# Altium schematic sheet POW.SchDoc
size A4; SheetNumber: 2; SheetTotal: 5
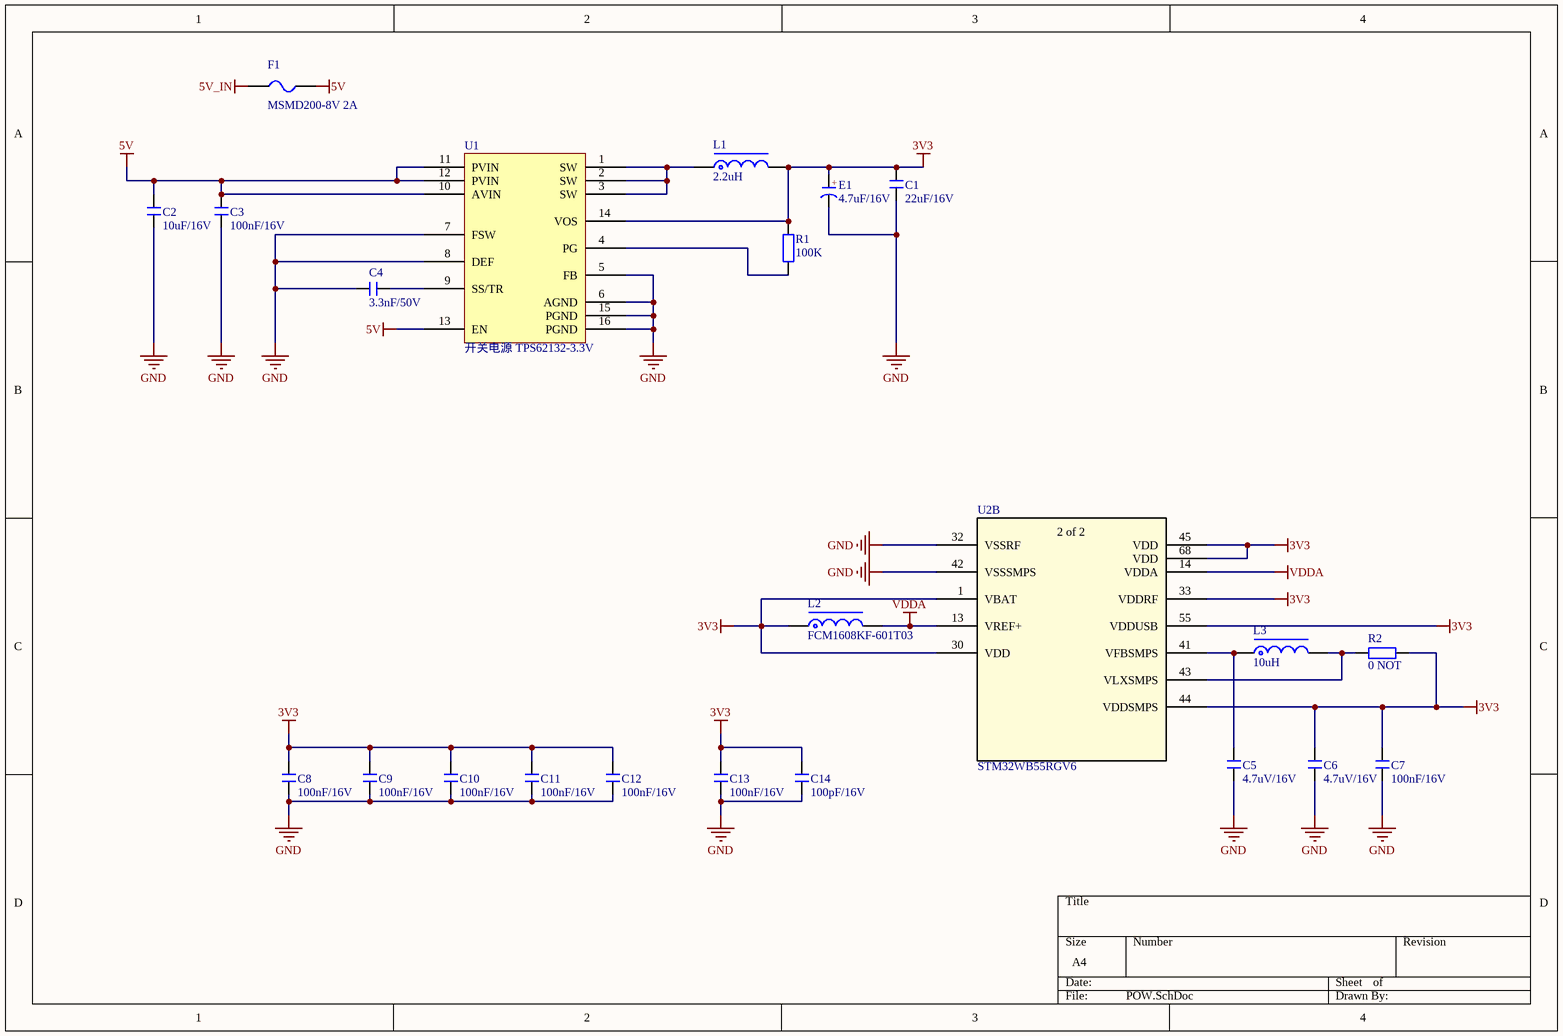
[diagram p0: POW.SchDoc]

## Parts
C1  22uF/16V  [C 0805_L]
C2  10uF/16V  [C 0603_L]
C3  100nF/16V  [C 0402_L]
C4  3.3nF/50V  [C 0402_L]
C5  4.7uV/16V  [C 0603_L]
C6  4.7uV/16V  [C 0603_L]
C7  100nF/16V  [C 0402_L]
C8  100nF/16V  [C 0402_L]
C9  100nF/16V  [C 0402_L]
C10  100nF/16V  [C 0402_L]
C11  100nF/16V  [C 0402_L]
C12  100nF/16V  [C 0402_L]
C13  100nF/16V  [C 0402_L]
C14  100pF/16V  [C 0402_L]
E1  4.7uF/16V  [CD A(3216)]
F1  MSMD200-8V 2A  [FU 0603]
L1  2.2uH  [电感XFL4020]
L2  FCM1608KF-601T03  [L 0402]
L3  10uH  [L 0805]
R1  100K  [R 0402_L]
R2  0 NOT  [R 0603_L]
U1  开关电源 TPS62132-3.3V  [QFN16]
U2  STM32WB55RGV6  [VFQFN68-8x8mm-M]  (part B of 2)

## Nets
3V3: C1.1 C6.2 C7.2 C8.2 C9.2 C10.2 C11.2 C12.2 C13.2 C14.2 E1.1(A) L1.2 L2.1 R1.2 R2.1 U1.14(VOS) U2.1(VBAT) U2.30(VDD) U2.33(VDDRF) U2.44(VDDSMPS) U2.45(VDD) U2.55(VDDUSB) U2.68(VDD)
5V: C2.2 C3.2 F1.2 U1.10(AVIN) U1.11(PVIN) U1.12(PVIN) U1.13(EN)
5V_IN: F1.1
GND: C1.2 C2.1 C3.1 C4.1 C5.1 C6.1 C7.1 C8.1 C9.1 C10.1 C11.1 C12.1 C13.1 C14.1 E1.2(K) U1.5(FB) U1.6(AGND) U1.7(FSW) U1.8(DEF) U1.15(PGND) U1.16(PGND) U2.32(VSSRF) U2.42(VSSSMPS)
VDDA: L2.2 U2.13(VREF+) U2.14(VDDA)
NetC4_2: C4.2 U1.9(SS/TR)
NetC5_2: C5.2 L3.1 U2.41(VFBSMPS)
NetL1_1: L1.1 U1.1(SW) U1.2(SW) U1.3(SW)
NetL3_2: L3.2 R2.2 U2.43(VLXSMPS)
NetR1_1: R1.1 U1.4(PG)

## Notes on the sheet
- (in symbol C-CD) +
- (in symbol STM32WB55RGV6, part B) 2 of 2

## Library data of the parts
C1 = C: 贴片电容; 主类型: 电容; 值精度: ±10%; 元件封装: 0805; 具体类型: 陶瓷电容; 封装类型: 贴片; 温度漂移: X7R（10%）; 温度范围: -55°C ~ 125°C; 生产商: SAMSUNG(三星); 生产商零件编码: CL21A226KOQNNNE; 值/型号: 22uF/16V; 立创编号: C296720
C2 = C: 贴片电容; 主类型: 电容; 值精度: ±10%; 元件封装: 0603; 具体类型: 陶瓷电容; 封装类型: 贴片; 温度漂移: X5R; 温度范围: -55°C ~ 125°C; 生产商: SAMSUNG(三星); 生产商零件编码: CL10A106MO8NQNC; 值/型号: 10uF/16V; 立创编号: C92487C70462
C3 C7-C13 = C: 贴片电容; 主类型: 电容; 值精度: ±10%; 元件封装: 0402; 具体类型: 陶瓷电容; 封装类型: 贴片; 温度漂移: X7R（15%）; 温度范围: -55°C ~ 125°C; 生产商: YAGEO(国巨); 生产商零件编码: CC0402KRX7R7BB104; 值/型号: 100nF/16V; 立创编号: C60474
C4 = C: 贴片电容; 主类型: 电容; 值精度: ±5%; 元件封装: 0402; 具体类型: 陶瓷电容; 封装类型: 贴片; 温度漂移: X7R（5%）; 温度范围: -55°C ~ 125°C; 生产商: YAGEO(国巨); 生产商零件编码: CC0402JRX7R9BB332; 值/型号: 3.3nF/50V; 立创编号: C541447
C5 C6 = C: 贴片电容; 主类型: 电容; 值/型号: 4.7uF/16V; 值精度: ±10%; 元件封装: 0603; 具体类型: 陶瓷电容; 封装类型: 贴片; 温度漂移: X5R（10%）; 温度范围: -55°C ~ 125°C; 生产商: muRata(村田); 生产商零件编码: GRM188R61C475KE11D; 立创编号: C77045
C14 = C: 贴片电容; 主类型: 电容; 值精度: ±5%; 元件封装: 0402; 具体类型: 陶瓷电容; 封装类型: 贴片; 温度漂移: NP0（5%）; 温度范围: -55°C ~ 125°C; 生产商: YAGEO(国巨); 生产商零件编码: CC0402JRNPO7BN101; 值/型号: 100pF/16V; 立创编号: C526991
E1 = C-CD: 聚合物电容 4.7uF/16V; 主类型: 电容; 值精度: ±20%; 元件封装: CASE-A_3216; 封装类型: 贴片; 温度范围: -55℃ ~ +105℃; 生产商: Sunlord(顺络); 生产商零件编码: TC211A475M016A; 值/型号: 4.7uF/16V; 具体类型: 聚合物电容; 立创编号: C136628
F1 = FU: 贴片保险丝
L1 = L-CD: XFL4020-222MEB; 主类型: 电感; 元件封装: 4020; 具体类型: 功率电感; 封装类型: 贴片; 温度范围: -40-125; 生产商: Coilcraft; 类型备注: 淘宝采购; 值/型号: XFL4020-222MEB; 生产商零件编码: XFL4020-222MEB; 立创编号: https://detail.tmall.com/item.htm?spm=a230r.1.14.16.717a6f292tX0SR&id=619184428761&ns=1&abbucket=12
L2 = L-CD: 0805; 主类型: 电感; 元件封装: 0603; 具体类型: 功率电感; 封装类型: 贴片; 温度范围: -40-125; 生产商: 台庆; 值/型号: FCM1608KF-601T03; 生产商零件编码: FCM1608KF-601T03; 立创编号: C141723
L3 = L-CD: 74479777310A; 主类型: 电感; 元件封装: 0805; 具体类型: 功率电感; 封装类型: 贴片; 温度范围: -40-125; 生产商: WE; 类型备注: 淘宝采购; 值/型号: 74479777310A; 生产商零件编码: 74479777310A
R1 = R: 贴片电阻 0402 1%; 主类型: 电阻; 元件封装: 0402; 封装类型: 贴片; 温度漂移: ±100ppm/℃; 生产商: 国巨; 生产商零件编码: RC0402FR-07100KL; 值/型号: 100K; 值精度: ±1%; 具体类型: 贴片电阻; 立创编号: C60491
R2 = R: 贴片电阻 0402 1%; 主类型: 电阻; 值/型号: 0; 值精度: ±5%; 元件封装: 0603; 封装类型: 贴片; 温度漂移: -200ppm/℃~400ppm/℃; 生产商: 华新科(Walsin); 生产商零件编码: WR06X000PTL; 具体类型: 贴片电阻; 立创编号: C132607
U1 = 开关电源 TPS62133: 主类型: 线性稳压器; 值/型号: TPS62133RGTR; 元件封装: VQFN-16; 具体类型: LDO; 封装类型: 贴片; 温度范围: -40-85; 生产商: TI(德州仪器); 生产商零件编码: TPS62133RGTR; 立创编号: C73973
U2 = STM32WB55RGV6: No Description Available; Vendor: STMicroelectronics; Built_By: EMA_UL_Team; SourceLibrary: Updates_to_database_2020-10-19; Manufacturer_Part_Number: STM32WB55RGV6; Copyright: Copyright (C) 2018 Accelerated Designs. All rights reserved; RefDes: RefDes; Type: DEV